# Altium schematic sheet Adafruit_INA3221_Breakout.SchDoc: Adafruit INA3221 Breakout
size 230 x 250 mm; Origin: Eagle; OriginPath: C:\Users\Abdullah Basit\Downloads\Adafruit INA3221 Breakout.sch; OriginSheet: 1; Date: 20/04/2026 5:28:53 pm; SheetNumber: 1; Author: >AUTHOR; GateName_1: G$1; SymbolName_1: FRAME_A4_ADAFRUIT; LibraryName: microbuilder; DeviceSetName: FRAME_A4_ADAFRUIT; Sheet: Sheet:; AdafruitIndustries: Adafruit Industries; Drawing: Drawing:
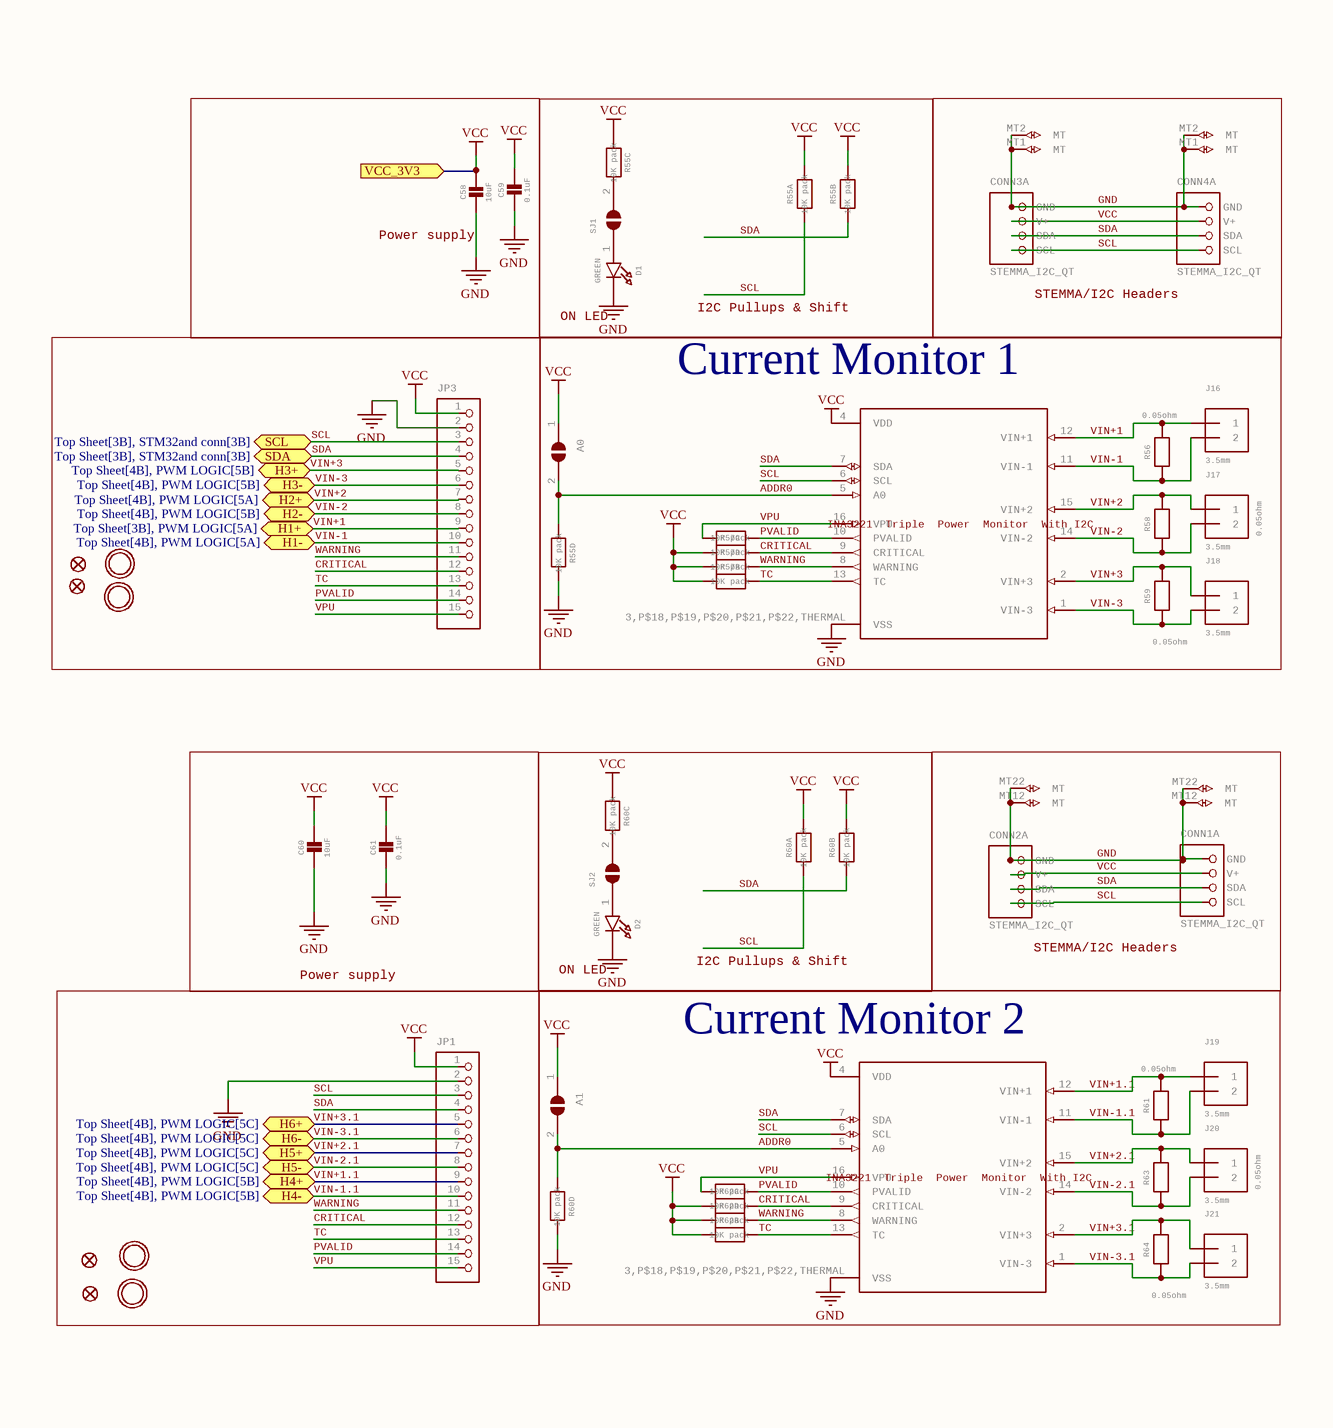
[diagram p0: Adafruit_INA3221_Breakout.SchDoc]

## Parts
A0  SOLDERJUMPERREFLOW_NOPASTE  [SOLDERJUMPER_REFLOW_NOPASTE]  (value not drawn)
A1  SOLDERJUMPERREFLOW_NOPASTE  [SOLDERJUMPER_REFLOW_NOPASTE]  (value not drawn)
C58  10uF  [0805-NO]
C59  0.1uF  [0603-NO]
C60  10uF  [0805-NO]
C61  0.1uF  [0603-NO]
CONN1  STEMMA_I2C_QT  [JST_SH4]  (part A of 3)
CONN2  STEMMA_I2C_QT  [JST_SH4]  (part A of 3)
CONN3  STEMMA_I2C_QT  [JST_SH4]  (parts A,B,C of 3)
CONN4  STEMMA_I2C_QT  [JST_SH4]  (parts A,B,C of 3)
CONN5  STEMMA_I2C_QT  [JST_SH4]  (value not drawn)  (parts B,C of 3)
CONN6  STEMMA_I2C_QT  [JST_SH4]  (value not drawn)  (parts B,C of 3)
D1  GREEN  [CHIPLED_0603_NOOUTLINE]
D2  GREEN  [CHIPLED_0603_NOOUTLINE]
FID1  FIDUCIAL_1MM  [FIDUCIAL_1MM]  (value not drawn)
FID2  FIDUCIAL_1MM  [FIDUCIAL_1MM]  (value not drawn)
FID3  FIDUCIAL_1MM  [FIDUCIAL_1MM]  (value not drawn)
FID4  FIDUCIAL_1MM  [FIDUCIAL_1MM]  (value not drawn)
IC4  INA3221
Triple
Power
Monitor
WithI2C: INA3221 / Triple / Power / Monitor / With I2C  [PVQFN-16]  (hidden comment: INA3221)
IC5  INA3221
Triple
Power
Monitor
WithI2C: INA3221 / Triple / Power / Monitor / With I2C  [PVQFN-16]  (hidden comment: INA3221)
J16  3.5mm  [TERMBLOCK_1X2-3.5MM]
J17  3.5mm  [TERMBLOCK_1X2-3.5MM]
J18  3.5mm  [TERMBLOCK_1X2-3.5MM]
J19  3.5mm  [TERMBLOCK_1X2-3.5MM]
J20  3.5mm  [TERMBLOCK_1X2-3.5MM]
J21  3.5mm  [TERMBLOCK_1X2-3.5MM]
JP1  HEADER-1X15  [1X15_ROUND_70]  (value not drawn)
JP3  HEADER-1X15  [1X15_ROUND_70]  (value not drawn)
R55  10K pack  [RESPACK_4X0603]  (parts A,B,C,D of 4)
R56  0.05ohm  [_1206]
R57  10K pack  [RESPACK_4X0603]  (parts A,B,C,D of 4)
R58  0.05ohm  [_1206]
R59  0.05ohm  [_1206]
R60  10K pack  [RESPACK_4X0603]  (parts A,B,C,D of 4)
R61  0.05ohm  [_1206]
R62  10K pack  [RESPACK_4X0603]  (parts A,B,C,D of 4)
R63  0.05ohm  [_1206]
R64  0.05ohm  [_1206]
SJ1  SOLDERJUMPERCLOSED  [SOLDERJUMPER_CLOSEDWIRE]  (value not drawn)
SJ2  SOLDERJUMPERCLOSED  [SOLDERJUMPER_CLOSEDWIRE]  (value not drawn)
U$1  MOUNTINGHOLE2.5  [MOUNTINGHOLE_2.5_PLATED]  (value not drawn)
U$2  MOUNTINGHOLE2.5  [MOUNTINGHOLE_2.5_PLATED]  (value not drawn)
U$20  MOUNTINGHOLE2.5  [MOUNTINGHOLE_2.5_PLATED]  (value not drawn)
U$21  MOUNTINGHOLE2.5  [MOUNTINGHOLE_2.5_PLATED]  (value not drawn)

## Blocks framed on the sheet
Power supply: C58 C59
STEMMA/I2C Headers: CONN3 CONN4
Current Monitor 1: A0 IC4 J16-J18 R55-R59
Power supply: C60 C61
STEMMA/I2C Headers: CONN1 CONN2 CONN5 CONN6
Current Monitor 2: A1 IC5 J19-J21 R60-R64

## Ports
H1+ (bidir, see Top Sheet[3B], PWM LOGIC[5A]), H1- (bidir, see Top Sheet[4B], PWM LOGIC[5A]), H2+ (bidir, see Top Sheet[4B], PWM LOGIC[5A]), H2- (bidir, see Top Sheet[4B], PWM LOGIC[5B]), H3+ (bidir, see Top Sheet[4B], PWM LOGIC[5B]), H3- (bidir, see Top Sheet[4B], PWM LOGIC[5B]), H4+ (bidir, see Top Sheet[4B], PWM LOGIC[5B]), H4- (bidir, see Top Sheet[4B], PWM LOGIC[5B]), H5+ (bidir, see Top Sheet[4B], PWM LOGIC[5C]), H5- (bidir, see Top Sheet[4B], PWM LOGIC[5C]), H6+ (bidir, see Top Sheet[4B], PWM LOGIC[5C]), H6- (bidir, see Top Sheet[4B], PWM LOGIC[5C]), SCL (bidir, see Top Sheet[3B], STM32and conn[3B]), SDA (bidir, see Top Sheet[3B], STM32and conn[3B]), VCC_3V3 (in, see Top Sheet[3A], PWM LOGIC[2A], PWM LOGIC[2D], STM32and conn[3C])

## Nets
GND: C58.2 C59.2 C60.2 C61.2 CONN1.1(GND) CONN2.1(GND) CONN3.1(GND) CONN3.MT1(MT) CONN3.MT2(MT) CONN4.1(GND) CONN4.MT1(MT) CONN4.MT2(MT) CONN5.MT12(MT) CONN5.MT22(MT) CONN6.MT12(MT) CONN6.MT22(MT) D1.C D2.C IC4.3,P$18,P$19,P$20,P$21,P$22,THERMAL(VSS) IC5.3,P$18,P$19,P$20,P$21,P$22,THERMAL(VSS) JP1.2 JP3.2 R55.5 R60.5
VCC: A0.1 A1.1 C58.1 C59.1 C60.1 C61.1 CONN1.2(V+) CONN2.2(V+) CONN3.2(V+) CONN4.2(V+) IC4.4(VDD) IC5.4(VDD) JP1.1 JP3.1 R55.3 R55.7 R55.8 R57.2 R57.3 R57.4 R60.3 R60.7 R60.8 R62.2 R62.3 R62.4 ; port VCC_3V3
ADDR0: A0.2 A1.2 IC4.5(A0) IC5.5(A0) R55.4 R60.4
CRITICAL: IC4.9(CRITICAL) IC5.9(CRITICAL) JP1.12 JP3.12 R57.6 R62.6
H4+: JP1.9 ; port H4+
H5+: JP1.7 ; port H5+
H6+: JP1.5 ; port H6+
PVALID: IC4.10(PVALID) IC5.10(PVALID) JP1.14 JP3.14 R57.8 R62.8
SCL: CONN1.4(SCL) CONN2.4(SCL) CONN3.4(SCL) CONN4.4(SCL) IC4.6(SCL) IC5.6(SCL) JP1.3 JP3.3 R55.1 R60.1 ; port SCL
SDA: CONN1.3(SDA) CONN2.3(SDA) CONN3.3(SDA) CONN4.3(SDA) IC4.7(SDA) IC5.7(SDA) JP1.4 JP3.4 R55.2 R60.2 ; port SDA
TC: IC4.13(TC) IC5.13(TC) JP1.13 JP3.13 R57.7 R62.7
VIN+1: IC4.12(VIN+1) J16.1 JP3.9 R56.2 ; port H1+
VIN+1.1: IC5.12(VIN+1) J19.1 R61.2
VIN+2: IC4.15(VIN+2) J17.1 JP3.7 R58.2 ; port H2+
VIN+2.1: IC5.15(VIN+2) J20.1 R63.2
VIN+3: IC4.2(VIN+3) J18.1 JP3.5 R59.2 ; port H3+
VIN+3.1: IC5.2(VIN+3) J21.1 R64.2
VIN-1: IC4.11(VIN-1) J16.2 JP3.10 R56.1 ; port H1-
VIN-1.1: IC5.11(VIN-1) J19.2 JP1.10 R61.1 ; port H4-
VIN-2: IC4.14(VIN-2) J17.2 JP3.8 R58.1 ; port H2-
VIN-2.1: IC5.14(VIN-2) J20.2 JP1.8 R63.1 ; port H5-
VIN-3: IC4.1(VIN-3) J18.2 JP3.6 R59.1 ; port H3-
VIN-3.1: IC5.1(VIN-3) J21.2 JP1.6 R64.1 ; port H6-
VPU: IC4.16(VPU) IC5.16(VPU) JP1.15 JP3.15 R57.1 R62.1
WARNING: IC4.8(WARNING) IC5.8(WARNING) JP1.11 JP3.11 R57.5 R62.5
NetD1_A: D1.A SJ1.1
NetD2_A: D2.A SJ2.1
NetR55_6: R55.6 SJ1.2
NetR60_6: R60.6 SJ2.2

## Notes on the sheet
- (near D1) ON LED
- I2C Pullups & Shift
- (near D2) ON LED
- Labels drawn without touching a wire or pin: VIN+1.1, VIN+2.1, VIN+3.1

## Library data of the parts
A0 A1 = SOLDERJUMPERREFLOW_NOPASTE: SMD Solder JUMPER   Solder the two pads together to create a connection, or remove the solder to break it.REFLOW - Use this footprint for solder paste and reflow ovens. WAVE - Use this footprint for hand-soldering (larger pads).    CLOSED - Has a trace between the two pads to ensure it is closed by default.  The trace needs to be cut to disable the jumper, and can be closed again by creating a solder bridge between the two pads.; GateName_1: 1; SymbolName_1: SOLDERJUMPER; DeviceName: REFLOW_NOPASTE; LibraryName: microbuilder; DeviceSetName: SOLDERJUMPER
C58 C60 = CAP_CERAMIC0805-NOOUTLINE: Ceramic Capacitors   For new designs, use the packages preceded by an '_' character since they are more reliable:   The following footprints should be used on most boards: _0402 - Standard footprint for regular board layouts  _0603 - Standard footprint for regular board layouts  _0805 - Standard footprint for regular board layouts  _1206 - Standard footprint for regular board layouts       For extremely tight-pitch boards where space is at a premium, the following 'micro-pitch' footprints can be used (smaller pads, no silkscreen outline, etc.): _0402MP - Micro-pitch footprint for very dense/compact boards  _0603MP - Micro-pitch footprint for very dense/compact boards  _0805MP - Micro-pitch footprint for very dense/compact boards  _1206MP - Micro-pitch footprint for very dense/compact boards; GateName_1: G$1; SymbolName_1: CAPACITOR; DeviceName: 0805-NOOUTLINE; LibraryName: microbuilder; DeviceSetName: CAP_CERAMIC
C59 C61 = CAP_CERAMIC0603_NO: Ceramic Capacitors   For new designs, use the packages preceded by an '_' character since they are more reliable:   The following footprints should be used on most boards: _0402 - Standard footprint for regular board layouts  _0603 - Standard footprint for regular board layouts  _0805 - Standard footprint for regular board layouts  _1206 - Standard footprint for regular board layouts       For extremely tight-pitch boards where space is at a premium, the following 'micro-pitch' footprints can be used (smaller pads, no silkscreen outline, etc.): _0402MP - Micro-pitch footprint for very dense/compact boards  _0603MP - Micro-pitch footprint for very dense/compact boards  _0805MP - Micro-pitch footprint for very dense/compact boards  _1206MP - Micro-pitch footprint for very dense/compact boards; GateName_1: G$1; SymbolName_1: CAPACITOR; DeviceName: 0603_NO; LibraryName: microbuilder; DeviceSetName: CAP_CERAMIC
CONN1-CONN6 = STEMMA_I2C_QT: GateName_1: G$1; GateName_2: G$2; SymbolName_2: MOUNTING; GateName_3: G$3; DeviceName: _QT; SymbolName_1: STEMMA_I2C; SymbolName_3: MOUNTING; LibraryName: adafruit_electromech; DeviceSetName: STEMMA_I2C; LCSC: C2845363
D1 D2 = LED0603_NOOUTLINE: LED0603 - 0603 Surface Mount Package    2mA: Green LED - Low Power (3.9mcd, 2ma, 1.7Vf) - Digikey: 475-2709-2-ND  Orange LED - Low Power (9.8mcd, 2ma, 1.8Vf) - Digikey: 475-1194-2-ND  Red LED - Low Power (5mcd, 2ma, 1.8Vf) - Digikey: 475-1195-2-ND  Yellow LED - Low Power (7mcd, 2ma, 1.8Vf) - Digikey: 475-1196-2-ND       5mA: Blue LED - Low Power (17mcd, 5ma, 2.9Vf) - Digikey: LNJ937W8CRACT-ND    0805 - 0805 Surface Mount Package    2mA: Red LED (8.8mcd, 2mA, 1.8Vf, Clear) - Low Power [Digikey: 475-2510-1-ND]  Green LED (5mcd, 2mA, 1.8Vf, Clear) - Low Power [Digikey: 475-2730-1-ND]  Yellow LED (11.3mcd, 2mA, 1.8Vf, Clear) - Low Power [Digikey: 475-2555-1-ND]       20mA: Red LED (104mcd, 20mA, Diffused) - LS R976 [Digikey: 475-1278-6-ND]  Red LED (12mcd, 20mA, 2.0Vf, Clear) - APT2012EC [Digikey: 754-1128-1-ND]  Green LED (15mcd, 20mA, 2.2Vf, Clear) - APT2012GC [Digikey: 754-1131-1-ND]  Orange LED (160mcd, 20mA, 2.1Vf, Clear) - APT2012SECK [Digikey: 754-1130-1-ND]     1206 - 1206 Surface Mount Package  Green LED (26mcd, 20mA, Diffused) - LG N971  [Digikey: 475-1407-6-ND]  Red LED (15mcd, 20mA, Diffused) - LH N974 [Digikey: 475-1416-6-ND]     Cree - Cree High-Power Surface Mount LEDs  XPEBWT-L1-0000-00D50 - White 111lm 350mA 2.9Vf 6200K 110Â°  XTEAWT-00-0000-00000LEE3 - White 114lm 350mA 2.85Vf 5000K 115Â°     Everlight - Everlight 45-21 Series Surface Mount LEDs  45-21/QK2C-B2832AC2CB2/2T - Warm White 2000mcd 20mA 3.25Vf 3050K 120Â°  45-21/LK2C-B38452C4CB2/2T - Nuetral White 2000mcd 20mA 3.25Vf 4150K 120Â°  45-21/LK2C-B50634C6CB2/2T - Cold White 2200mcd 20mA 3.25Vf 5650K 120Â°     PLCC2 Reverse Mount LS T77K-J1L2-1-0-2-R18-Z - Red 11.25mcd 2mA 1.8Vf 630nm 120Â°  LO T77K-L1M2-24-Z - Orange 19.6mcd 2mA 1.8Vf 606nm 120Â°  LY T77K-K2M1-26-Z - Yellow 15.7mcd 2mA 1.8Vf 587nm 120Â°; GateName_1: G$1; ROT: 270; SymbolName_1: LED; DeviceName: 0603_NOOUTLINE; LibraryName: microbuilder; DeviceSetName: LED
FID1-FID4 = FIDUCIAL_1MM: Fiducial Alignment Points   Various fiducial points for machine vision alignment.; GateName_1: G$1; DeviceName: _1MM; BOM: EXCLUDE; SymbolName_1: FIDUCIAL; LibraryName: microbuilder; DeviceSetName: FIDUCIAL
IC4 IC5 = INA3221: GateName_1: G$1; SymbolName_1: INA3221; LibraryName: adafruit_power; DeviceSetName: INA3221
J16-J21 = TERMBLOCK_1X2_3.5MM: 3.5mm Terminal block    http://www.ladyada.net/library/pcb/eaglelibrary.html; GateName_1: G$1; SymbolName_1: 1X2; DeviceName: _3.5MM; ROT: 180; LibraryName: adafruit_electromech; DeviceSetName: TERMBLOCK_1X2
JP1 JP3 = HEADER-1X15: 1x15 Header; GateName_1: G$1; SymbolName_1: PINHD15; LibraryName: microbuilder; DeviceSetName: HEADER-1X15
R55 R57 R60 R62 = RESISTOR_4PACK: Resistor Packs (4 resistors)   4 x 0603 10K 1/16W - Digikey: YC164J-10KCT-ND; GateName_1: G$1; GateName_2: G$2; GateName_3: G$3; GateName_4: G$4; SymbolName_1: RESISTOR; SymbolName_2: RESISTOR; SymbolName_3: RESISTOR; SymbolName_4: RESISTOR; LibraryName: microbuilder; DeviceSetName: RESISTOR_4PACK
R56 R58 R59 R61 R63 R64 = RESISTOR_1206: Resistors   For new designs, use the packages preceded by an '_' character since they are more reliable:   The following footprints should be used on most boards: _0402 - Standard footprint for regular board layouts  _0603 - Standard footprint for regular board layouts  _0805 - Standard footprint for regular board layouts  _1206 - Standard footprint for regular board layouts       For extremely tight-pitch boards where space is at a premium, the following 'micro-pitch' footprints can be used (smaller pads, no silkscreen outline, etc.): _0402MP - Micro-pitch footprint for very dense/compact boards  _0603MP - Micro-pitch footprint for very dense/compact boards  _0805MP - Micro-pitch footprint for very dense/compact boards  _1206MP - Micro-pitch footprint for very dense/compact boards; GateName_1: G$1; SymbolName_1: RESISTOR; DeviceName: _1206; LibraryName: microbuilder; DeviceSetName: RESISTOR
SJ1 SJ2 = SOLDERJUMPERCLOSED: SMD Solder JUMPER   Solder the two pads together to create a connection, or remove the solder to break it.REFLOW - Use this footprint for solder paste and reflow ovens. WAVE - Use this footprint for hand-soldering (larger pads).    CLOSED - Has a trace between the two pads to ensure it is closed by default.  The trace needs to be cut to disable the jumper, and can be closed again by creating a solder bridge between the two pads.; GateName_1: 1; SymbolName_1: SOLDERJUMPER; DeviceName: CLOSED; LibraryName: microbuilder; DeviceSetName: SOLDERJUMPER
U$1 U$2 U$20 U$21 = MOUNTINGHOLE2.5: Mounting Hole   For #2 screws (0.086"/2.18mm width, 0.094"/2.4mm hole) use 2.5mm; GateName_1: G$1; DeviceName: 2.5; BOM: EXCLUDE; SymbolName_1: MOUNTINGHOLE; LibraryName: adafruit_electromech; DeviceSetName: MOUNTINGHOLE